# Altium schematic sheet FIT_HDMI_X16-33.SchDoc: FIT_PM12 board
size 420 x 297 mm; CheckedBy: G.Kasprowicz; Author: INR Moscow; CompanyName: WUT ISE; DrawnBy: M.Podgórski; Organization: WUT ISE; Address1: PW ISE; Address2: Nowowiejska 15/19 00-665 Warsaw; Address3: gkasprow@gmail.com; Revision: 2; SheetNumber: -; SheetTotal: -; ModifiedBy: -; CheckedDate: -; Title2: Title 2; DivGrp: WUT ISE; Designer: INR RAS; ModifiedDate: -; ProjectName: Sensor Box
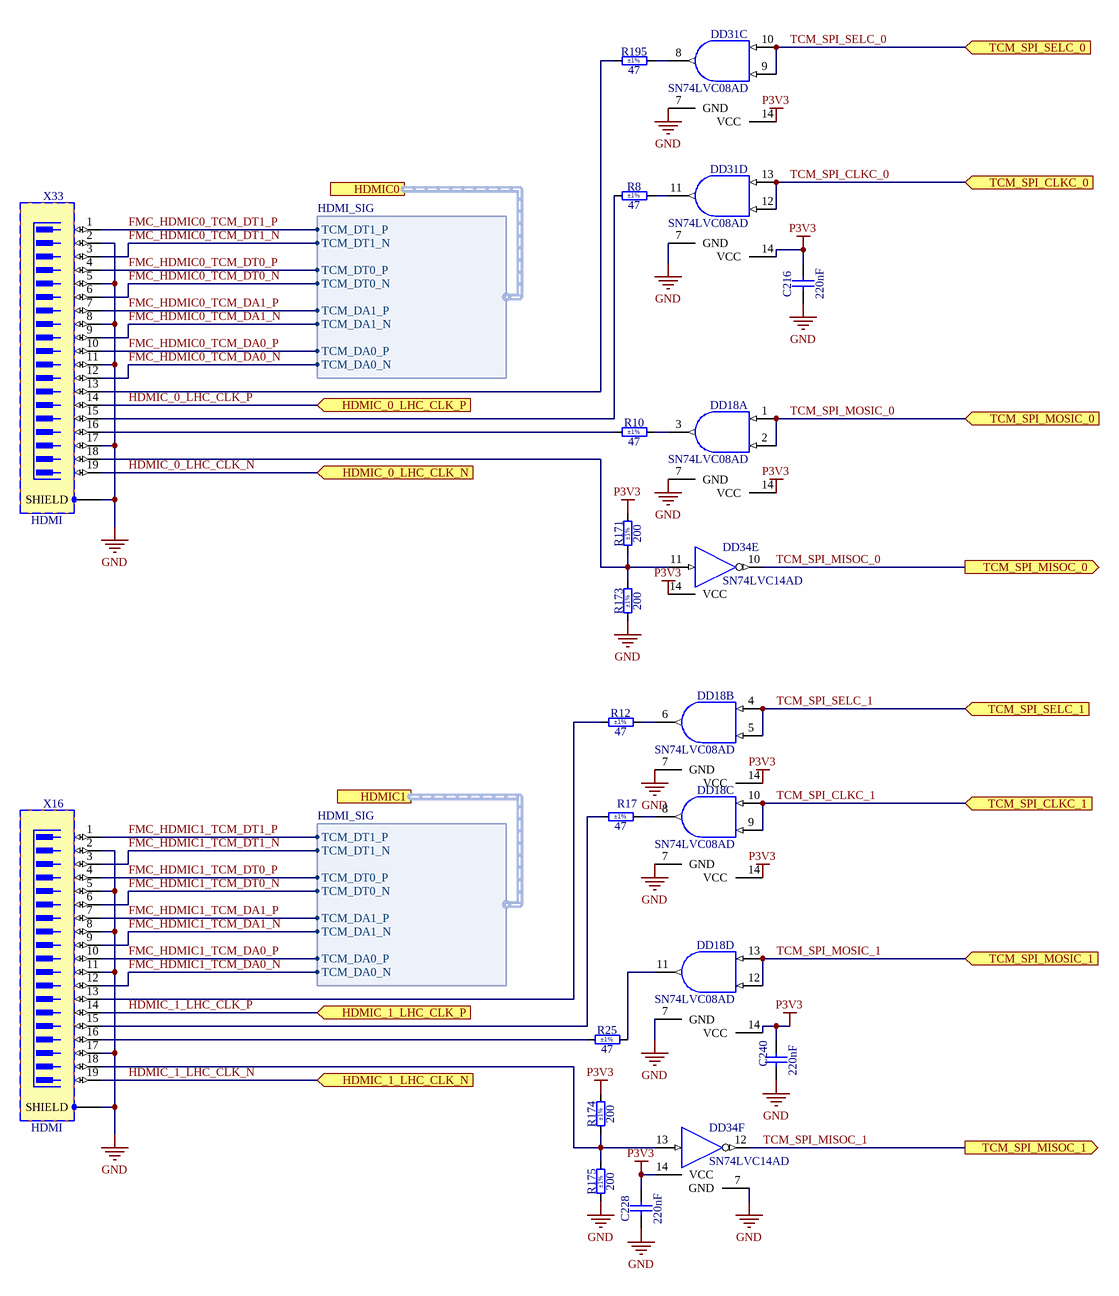
[diagram p0: FIT_HDMI_X16-33.SchDoc]

## Parts
C216  220nF  [CAPC2012X135N]
C228  220nF  [CAPC2012X135N]
C240  220nF  [CAPC2012X135N]
DD18  SN74LVC08AD  [SOIC127P600X175-14N]  (parts A,B,C,D of 4)
DD31  SN74LVC08AD  [SOIC127P600X175-14N]  (parts C,D of 4)
DD34  SN74LVC14AD  [SOIC127P600X175-14N]  (parts E,F of 6)
R8  47  Tolerance: ±1%  [RESC2012X60N]
R10  47  Tolerance: ±1%  [RESC2012X60N]
R12  47  Tolerance: ±1%  [RESC2012X60N]
R17  47  Tolerance: ±1%  [RESC2012X60N]
R25  47  Tolerance: ±1%  [RESC2012X60N]
R171  200  Tolerance: ±1%  [RESC2012X60N]
R173  200  Tolerance: ±1%  [RESC2012X60N]
R174  200  Tolerance: ±1%  [RESC2012X60N]
R175  200  Tolerance: ±1%  [RESC2012X60N]
R195  47  Tolerance: ±1%  [RESC2012X60N]
X16  HDMI  [TYCO_2007435-1]
X33  HDMI  [TYCO_2007435-1]

## Ports
HDMIC0 (harness HDMI_SIG), HDMIC1 (harness HDMI_SIG), HDMIC_0_LHC_CLK_N (in), HDMIC_0_LHC_CLK_P (in), HDMIC_1_LHC_CLK_N (in), HDMIC_1_LHC_CLK_P (in), TCM_SPI_CLKC_0 (in), TCM_SPI_CLKC_1 (in), TCM_SPI_MISOC_0 (out), TCM_SPI_MISOC_1 (out), TCM_SPI_MOSIC_0 (in), TCM_SPI_MOSIC_1 (in), TCM_SPI_SELC_0 (in), TCM_SPI_SELC_1 (in)

## Harnesses
HDMI_SIG: TCM_DT1_P, TCM_DT1_N, TCM_DT0_P, TCM_DT0_N, TCM_DA1_P, TCM_DA1_N, TCM_DA0_P, TCM_DA0_N

## Nets
GND: C216.1 C228.1 C240.1 DD18.7(GND) DD31.7(GND) DD34.7(GND) R173.1 R175.1 X16.2 X16.5 X16.8 X16.11 X16.17 X16.SHIELD X33.2 X33.5 X33.8 X33.11 X33.17 X33.SHIELD
P3V3: C216.2 C228.2 C240.2 DD18.14(VCC) DD31.14(VCC) DD34.14(VCC) R171.2 R174.2  [also labelled VCC]
FMC_HDMIC0_TCM_DA0_N: X33.12 ; port HDMIC0.TCM_DA0_N
FMC_HDMIC0_TCM_DA0_P: X33.10 ; port HDMIC0.TCM_DA0_P
FMC_HDMIC0_TCM_DA1_N: X33.9 ; port HDMIC0.TCM_DA1_N
FMC_HDMIC0_TCM_DA1_P: X33.7 ; port HDMIC0.TCM_DA1_P
FMC_HDMIC0_TCM_DT0_N: X33.6 ; port HDMIC0.TCM_DT0_N
FMC_HDMIC0_TCM_DT0_P: X33.4 ; port HDMIC0.TCM_DT0_P
FMC_HDMIC0_TCM_DT1_N: X33.3 ; port HDMIC0.TCM_DT1_N
FMC_HDMIC0_TCM_DT1_P: X33.1 ; port HDMIC0.TCM_DT1_P
FMC_HDMIC1_TCM_DA0_N: X16.12 ; port HDMIC1.TCM_DA0_N
FMC_HDMIC1_TCM_DA0_P: X16.10 ; port HDMIC1.TCM_DA0_P
FMC_HDMIC1_TCM_DA1_N: X16.9 ; port HDMIC1.TCM_DA1_N
FMC_HDMIC1_TCM_DA1_P: X16.7 ; port HDMIC1.TCM_DA1_P
FMC_HDMIC1_TCM_DT0_N: X16.6 ; port HDMIC1.TCM_DT0_N
FMC_HDMIC1_TCM_DT0_P: X16.4 ; port HDMIC1.TCM_DT0_P
FMC_HDMIC1_TCM_DT1_N: X16.3 ; port HDMIC1.TCM_DT1_N
FMC_HDMIC1_TCM_DT1_P: X16.1 ; port HDMIC1.TCM_DT1_P
HDMIC_0_LHC_CLK_N: X33.19 ; port HDMIC_0_LHC_CLK_N
HDMIC_0_LHC_CLK_P: X33.14 ; port HDMIC_0_LHC_CLK_P
HDMIC_1_LHC_CLK_N: X16.19 ; port HDMIC_1_LHC_CLK_N
HDMIC_1_LHC_CLK_P: X16.14 ; port HDMIC_1_LHC_CLK_P
TCM_SPI_CLKC_0: DD31.12(B) DD31.13(A) ; port TCM_SPI_CLKC_0
TCM_SPI_CLKC_1: DD18.9(B) DD18.10(A) ; port TCM_SPI_CLKC_1
TCM_SPI_MISOC_0: DD34.10(OUT) ; port TCM_SPI_MISOC_0
TCM_SPI_MISOC_1: DD34.12(OUT) ; port TCM_SPI_MISOC_1
TCM_SPI_MOSIC_0: DD18.1(A) DD18.2(B) ; port TCM_SPI_MOSIC_0
TCM_SPI_MOSIC_1: DD18.12(B) DD18.13(A) ; port TCM_SPI_MOSIC_1
TCM_SPI_SELC_0: DD31.9(B) DD31.10(A) ; port TCM_SPI_SELC_0
TCM_SPI_SELC_1: DD18.4(A) DD18.5(B) ; port TCM_SPI_SELC_1
NetDD18_3: DD18.3(Y) R10.2
NetDD18_6: DD18.6(Y) R12.2
NetDD18_8: DD18.8(Y) R17.2
NetDD18_11: DD18.11(Y) R25.2
NetDD31_8: DD31.8(Y) R195.2
NetDD31_11: DD31.11(Y) R8.2
NetDD34_11: DD34.11(IN) R171.1 R173.2 X33.18
NetDD34_13: DD34.13(IN) R174.1 R175.2 X16.18
NetR8_1: R8.1 X33.15
NetR10_1: R10.1 X33.16
NetR12_1: R12.1 X16.13
NetR17_1: R17.1 X16.15
NetR25_1: R25.1 X16.16
NetR195_1: R195.1 X33.13

## Notes on the sheet
- Project/Equipment
- Document
- Designer
- Drawn by
- Check.by
- Copyright WUT ISE 2024.
  This documentation describes Open Hardware and is licensed under the CERN OHL v.2. You may redistribute and modify this documentation under the terms of the CERN OHL v.2. (http://ohwr.org/CERNOHL). This documentation is distributed WITHOUT ANY EXPRESS OR IMPLIED WARRANTY, INCLUDING OF MERCHANTABILITY, SATISFACTORY QUALITY AND FITNESS FOR A PARTICULAR PURPOSE. Please see the CERN OHL v.2 for applicable conditions.
- Contact
- File
- Last Mod.
- Print Date
- Sheet
- Size
- A3
- of
- Rev

## Library data of the parts
C216 C228 C240 = CC0805_220NF_50V_10%_X7R: Non-polarised capacitor; Part Description: SMD Multilayer Chip Ceramic Capacitor; Manufacturer: GENERIC; Manufacturer1 Part Number: GRM21BR71H224KA01L; Voltage: 50V; TC: X7R; Tolerance: ±10%; Part Number: CC0805_220NF_50V_10%_X7R; Component Kind: Standard; Component Type: Standard; Pin Count: 2; Value: 220nF; Status: Preferred; Manufacturer Part Number: CC0805_220NF_50V_10%_X7R; Case: 0805; Mounted: Yes; Socket: No; SMD: Yes; Sense: No; Manufacturer1 Example: MURATA; Manufacturer1 ComponentHeight: 1.35mm; HelpURL: \\cern.ch\dfs\Applications\Altium\Datasheets\CC0805_X7R_MURATA.pdf; Author: CERN DEM JLC; CreateDate: 03.12.2007; LatestRevisionDate: 03.12.2007
DD18 DD31 = SN74LVC08AD: Quad 2-Input AND Gate; Part Description: Quadruple 2-Input Positive-AND Gate; Manufacturer: TEXAS INSTRUMENTS; PressFit: No; Bonding: No; Part Number: SN74LVC08AD; Component Kind: Standard; Component Type: Standard; Device: SN74LVC08AD; PackageDescription: SOIC 14, Pitch 1.27mm - Body 4x8.75mm, IPC Medium Density; Manufacturer Part Number: SN74LVC08AD; Pin Count: 14; Case: SOIC14; Mounted: Yes; Socket: No; SMD: Yes; Sense: No; ComponentHeight: 1.75mm; Author: CERN DEM JLC; HelpURL: \\cern.ch\dfs\Applications\Altium\Datasheets\SN74LVC08AD.pdf; CreateDate: 21.03.2012; LatestRevisionDate: 21.03.2012
DD34 = SN74LVC14AD: Hex Schmitt-Trigger Inverter; Manufacturer: TEXAS INSTRUMENTS; PressFit: No; Bonding: No; Part Number: SN74LVC14AD; Component Kind: Standard; Component Type: Standard; Device: SN74LVC14AD; PackageDescription: SOIC 14, Pitch 1.27mm - Body 4x8.75mm, IPC Medium Density; Part Description: Hex Schmitt-Trigger Inverter; Manufacturer Part Number: SN74LVC14AD; Pin Count: 14; Case: SOIC14; Mounted: Yes; Socket: No; SMD: Yes; Sense: No; ComponentHeight: 1.75mm; Author: CERN DEM JMW; HelpURL: \\cern.ch\dfs\Applications\Altium\Datasheets\SN74LVC14AD.pdf; CreateDate: 29.09.2008; LatestRevisionDate: 29.09.2008
R8 R10 R12 R17 R25 R195 = R0805_47R_1%_0.125W_100PPM: Resistor - 1%; Part Description: General Purpose Thick Film Chip Resistor; Manufacturer: GENERIC; Manufacturer1 Part Number: NRC10F47R0TRF; Power: 0.125W; TC: ±100ppm/°C; PressFit: No; Part Number: R0805_47R_1%_0.125W_100PPM; Component Kind: Standard; Component Type: Standard; Pin Count: 2; Value: 47; Status: Preferred; Manufacturer Part Number: R0805_47R_1%_0.125W_100PPM; Case: 0805; Mounted: Yes; Sense: No; Socket: No; SMD: Yes; Manufacturer1 Example: NIC COMPONENT; Manufacturer1 ComponentHeight: 0.6mm; HelpURL: \\cern.ch\dfs\Applications\Altium\Datasheets\R0805_NIC_NRC.pdf; Author: CERN DEM JLC; CreateDate: 03.12.2007; LatestRevisionDate: 13.03.2008
R171 R173-R175 = R0805_200R_1%_0.125W_100PPM: Resistor - 1%; Part Description: General Purpose Thick Film Chip Resistor; Manufacturer: GENERIC; Manufacturer1 Part Number: NRC10F2000TRF; Power: 0.125W; TC: ±100ppm/°C; PressFit: No; Part Number: R0805_200R_1%_0.125W_100PPM; Component Kind: Standard; Component Type: Standard; Pin Count: 2; Value: 200; Status: Preferred; Manufacturer Part Number: R0805_200R_1%_0.125W_100PPM; Case: 0805; Mounted: Yes; Sense: No; Socket: No; SMD: Yes; Manufacturer1 Example: NIC COMPONENT; Manufacturer1 ComponentHeight: 0.6mm; HelpURL: \\cern.ch\dfs\Applications\Altium\Datasheets\R0805_NIC_NRC.pdf; Author: CERN DEM JLC; CreateDate: 03.12.2007; LatestRevisionDate: 13.03.2008
X16 X33 = TYCO_2007435-1: Connector HDMI 19 Male + 1 Shield; Part Description: 0.578mm Pitch, Through-Hole Right Angle 19 Contacts Flag-HDMI Type-A Receptacle Thru Hole Mounting Pads; Manufacturer: TYCO ELECTRONICS; PressFit: No; Part Number: TYCO_2007435-1; Component Kind: Standard; Component Type: Standard; Pin Count: 23; Family: HDMI; Mounted: Yes; Socket: No; SMD: No; Sense: No; Status: None; Manufacturer Part Number: 2007435-1; ComponentHeight: 16.4mm; HelpURL: \\cern.ch\dfs\Applications\Altium\Datasheets\TYCO_2007435-1.pdf; Author: CERN DEM MR; CreateDate: 05.07.2016; LatestRevisionDate: 05.07.2016